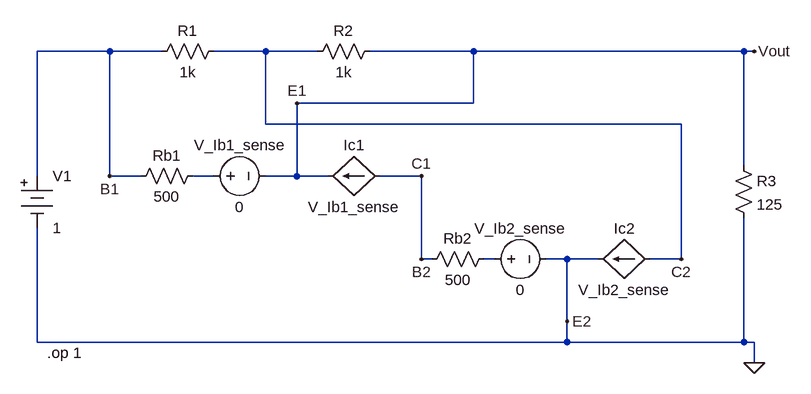
[diagram p0: schematic g3_p26.asc]
g3_p26.asc, the LTspice schematic file:
Version 4
SHEET 1 952 680
WIRE -112 0 -224 0
WIRE -32 0 -112 0
WIRE 128 0 48 0
WIRE 208 0 128 0
WIRE 448 0 288 0
WIRE 864 0 448 0
WIRE 880 0 864 0
WIRE 448 80 448 0
WIRE 448 80 176 80
WIRE 128 112 128 0
WIRE 768 112 128 112
WIRE 864 176 864 0
WIRE -224 192 -224 0
WIRE -112 192 -112 0
WIRE -64 192 -112 192
WIRE 48 192 16 192
WIRE 176 192 176 80
WIRE 176 192 128 192
WIRE 224 192 176 192
WIRE 368 192 304 192
WIRE 368 320 368 192
WIRE 384 320 368 320
WIRE 480 320 464 320
WIRE 592 320 560 320
WIRE 640 320 592 320
WIRE 768 320 768 112
WIRE 768 320 720 320
WIRE 592 416 592 320
WIRE -224 448 -224 272
WIRE 592 448 592 416
WIRE 592 448 -224 448
WIRE 864 448 864 256
WIRE 864 448 592 448
WIRE 880 448 864 448
WIRE 880 480 880 448
FLAG 880 480 0
FLAG 880 0 Vout
FLAG -112 192 B1
FLAG 368 320 B2
FLAG 368 192 C1
FLAG 176 80 E1
FLAG 592 416 E2
FLAG 768 320 C2
SYMBOL res 64 -16 R90
WINDOW 0 0 56 VBottom 2
WINDOW 3 32 56 VTop 2
SYMATTR InstName R1
SYMATTR Value 1k
SYMBOL res 304 -16 R90
WINDOW 0 0 56 VBottom 2
WINDOW 3 32 56 VTop 2
SYMATTR InstName R2
SYMATTR Value 1k
SYMBOL res 32 176 R90
WINDOW 0 0 56 VBottom 2
WINDOW 3 32 56 VTop 2
SYMATTR InstName Rb1
SYMATTR Value 500
SYMBOL res 480 304 R90
WINDOW 0 0 56 VBottom 2
WINDOW 3 32 56 VTop 2
SYMATTR InstName Rb2
SYMATTR Value 500
SYMBOL f 304 192 R90
WINDOW 0 -32 40 VBottom 2
WINDOW 3 32 40 VTop 2
SYMATTR InstName Ic1
SYMATTR Value V_Ib1_sense
SYMATTR Value2 1000
SYMBOL f 720 320 R90
WINDOW 0 -32 40 VBottom 2
WINDOW 3 32 40 VTop 2
SYMATTR InstName Ic2
SYMATTR Value V_Ib2_sense
SYMATTR Value2 1000
SYMBOL Misc\\battery -224 176 R0
SYMATTR InstName V1
SYMATTR Value 1
SYMBOL voltage 32 192 R270
WINDOW 0 32 56 VTop 2
WINDOW 3 -32 56 VBottom 2
SYMATTR InstName V_Ib1_sense
SYMATTR Value 0
SYMBOL voltage 464 320 R270
WINDOW 0 32 56 VTop 2
WINDOW 3 -32 56 VBottom 2
SYMATTR InstName V_Ib2_sense
SYMATTR Value 0
SYMBOL res 848 160 R0
SYMATTR InstName R3
SYMATTR Value 125
TEXT -208 464 Left 2 !.op 1

The netlist it stands for:
* g3_p26.asc
R1 C2 B1 1k
R2 E1 C2 1k
Rb1 N001 B1 500
Rb2 N002 C1 500
F§Ic1 C1 E1 V_Ib1_sense 1000
F§Ic2 C2 0 V_Ib2_sense 1000
V1 B1 0 1
V_Ib1_sense N001 E1 0
V_Ib2_sense N002 0 0
R3 E1 0 125
.op 1
.backanno
.end